# EasyEDA schematic SCH_ModExpES_2025-01-21.json
TITLE: ModExpES; REV: 1.2; Date: 2024-11-28; Sheet: 1/1; Drawn By: Ivo Tofall; Company: Hochschule Bonn-Rhein-Sieg
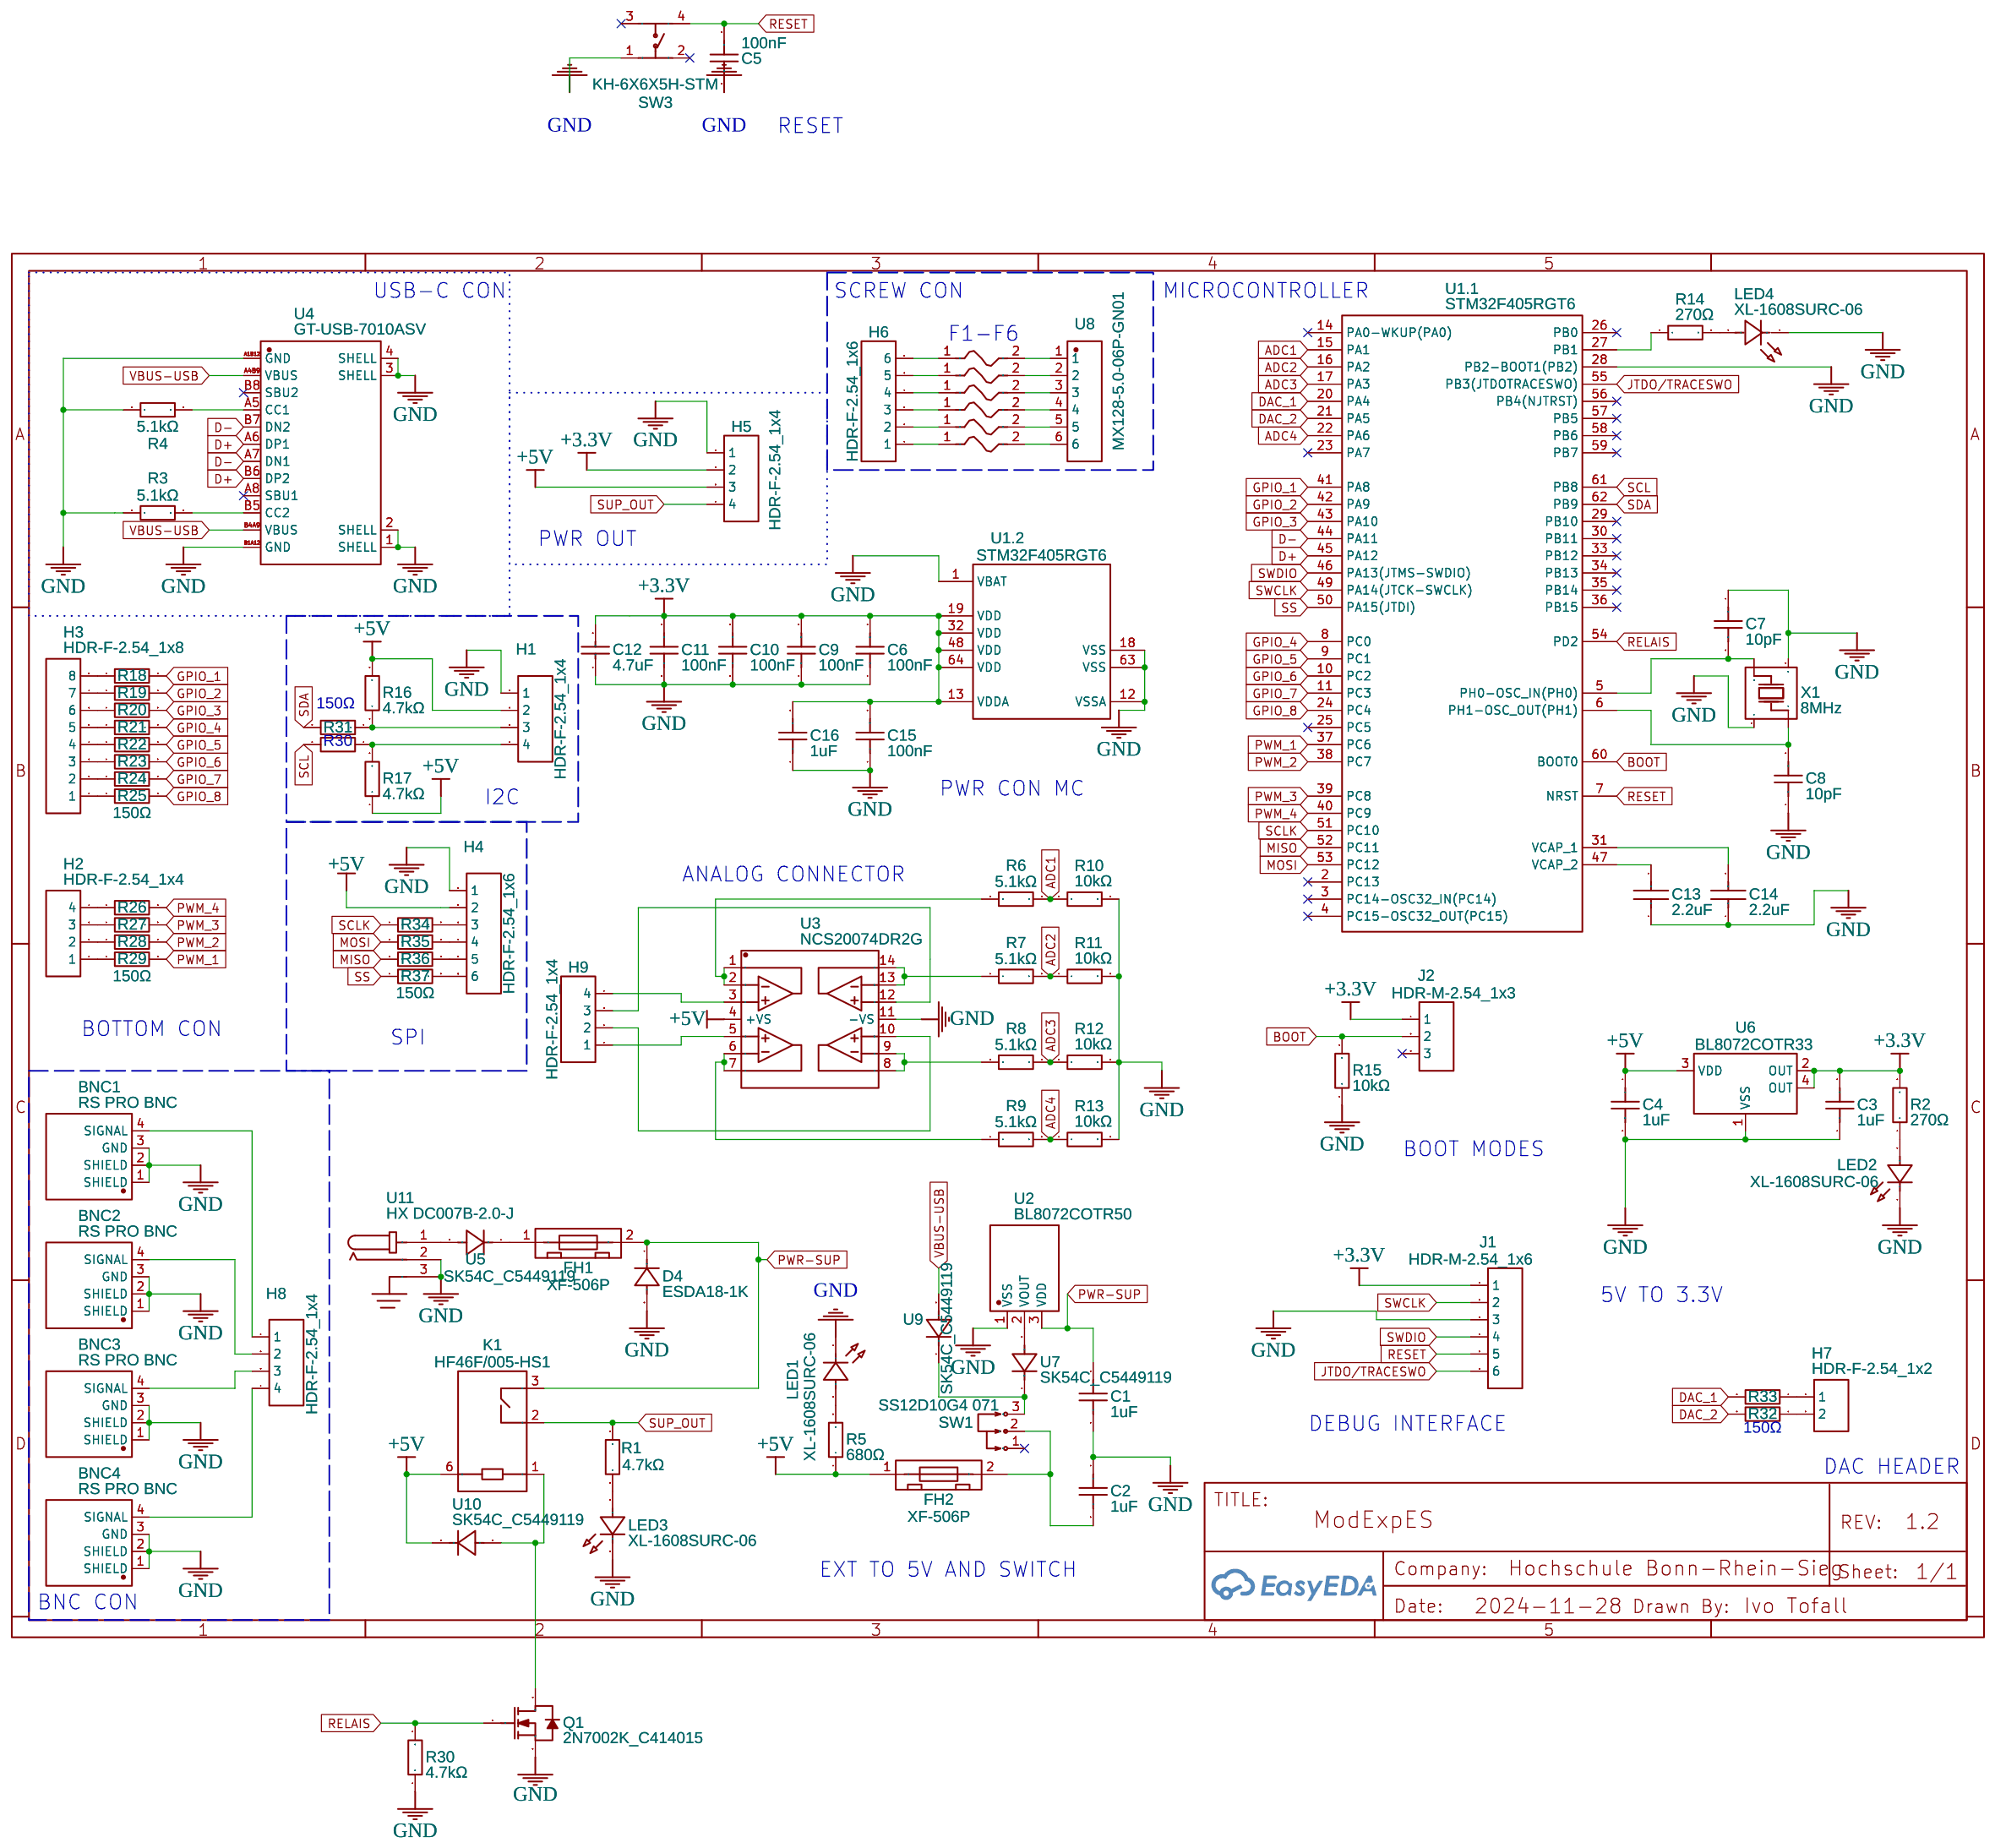
[diagram p0: schematic sheet]

## Parts
150Ω  150Ω  [R0603]
BNC1  RS PRO BNC  [RS PRO BUCHSE KOAXIALSTECKVERBINDER]
BNC2  RS PRO BNC  [RS PRO BUCHSE KOAXIALSTECKVERBINDER]
BNC3  RS PRO BNC  [RS PRO BUCHSE KOAXIALSTECKVERBINDER]
BNC4  RS PRO BNC  [RS PRO BUCHSE KOAXIALSTECKVERBINDER]
C1  1uF  [C0402]
C2  1uF  [C0402]
C3  1uF  [C0402]
C4  1uF  [C0402]
C5  100nF  [C0603]
C6  100nF  [C0402]
C7  10pF  [C0402]
C8  10pF  [C0402]
C9  100nF  [C0402]
C10  100nF  [C0402]
C11  100nF  [C0402]
C12  4.7uF  [C0603]
C13  2.2uF  [C0402]
C14  2.2uF  [C0402]
C15  100nF  [C0402]
C16  1uF  [C0402]
D4  ESDA18-1K  [SOD-523_L1.2-W0.8-LS1.6-RD-1]
F1  TLC-NSMD100/24  [F1206]
F2  TLC-NSMD100/24  [F1206]
F3  TLC-NSMD100/24  [F1206]
F4  TLC-NSMD100/24  [F1206]
F5  TLC-NSMD100/24  [F1206]
F6  TLC-NSMD100/24  [F1206]
FH1  XF-506P  [FUSE-TH_XF-506P]
FH2  XF-506P  [FUSE-TH_XF-506P]
H1  HDR-F-2.54_1x4  [HDR-F-2.54_1X4]
H2  HDR-F-2.54_1x4  [HDR-F-2.54_1X4]
H3  HDR-F-2.54_1x8  [HDR-F-2.54_1X8]
H4  HDR-F-2.54_1x6  [HDR-F-2.54_1X6]
H5  HDR-F-2.54_1x4  [HDR-F-2.54_1X4]
H6  HDR-F-2.54_1x6  [HDR-F-2.54_1X6]
H7  HDR-F-2.54_1x2  [HDR-F-2.54_1X2]
H8  HDR-F-2.54_1x4  [HDR-F-2.54_1X4]
H9  HDR-F-2.54_1x4  [HDR-F-2.54_1X4]
J1  HDR-M-2.54_1x6  [HDR-M-2.54_1X6]
J2  HDR-M-2.54_1x3  [HDR-M-2.54_1X3]
K1  HF46F/005-HS1  [RELAYS-TH_HF46F-XX-HS1-XXX]
LED1  XL-1608SURC-06  [LED0603-RD_RED]
LED2  XL-1608SURC-06  [LED0603-RD_RED]
LED3  XL-1608SURC-06  [LED0603-RD_RED]
LED4  XL-1608SURC-06  [LED0603-RD_RED]
Q1  2N7002K_C414015  [SOT-23-3_L2.9-W1.3-P1.90-LS2.4-BR]
R1  4.7kΩ  [R0805]
R2  270Ω  [R0603]
R3  5.1kΩ  [R0402]
R4  5.1kΩ  [R0402]
R5  680Ω  [R0603]
R6  5.1kΩ  [R0603]
R7  5.1kΩ  [R0603]
R8  5.1kΩ  [R0603]
R9  5.1kΩ  [R0603]
R10  10kΩ  [R0603]
R11  10kΩ  [R0603]
R12  10kΩ  [R0603]
R13  10kΩ  [R0603]
R14  270Ω  [R0603]
R15  10kΩ  [R0603]
R16  4.7kΩ  [R0805]
R17  4.7kΩ  [R0805]
R18  150Ω  [R0603]
R19  150Ω  [R0603]
R20  150Ω  [R0603]
R21  150Ω  [R0603]
R22  150Ω  [R0603]
R23  150Ω  [R0603]
R24  150Ω  [R0603]
R25  150Ω  [R0603]
R26  150Ω  [R0603]
R27  150Ω  [R0603]
R28  150Ω  [R0603]
R29  150Ω  [R0603]
R30  4.7kΩ  [R0805]
R31  150Ω  [R0603]
R32  150Ω  [R0603]
R33  150Ω  [R0603]
R34  150Ω  [R0603]
R35  150Ω  [R0603]
R36  150Ω  [R0603]
R37  150Ω  [R0603]
SW1  SS12D10G4 071  [SW-TH_SHOU-HAN_SS12D10G4]
SW3  KH-6X6X5H-STM  [SW-SMD_4P-L6.0-W6.0-P4.50-LS9.0-2]
U1  STM32F405RGT6  [LQFP-64_L10.0-W10.0-P0.50-LS12.0-BL]  (sections 1,2)
U2  BL8072COTR50  [TO-252-2_L6.5-W6.1-P4.58-LS10.0-BR-1]
U3  NCS20074DR2G  [SOIC-14_L8.7-W3.9-P1.27-LS6.0-BL]
U4  GT-USB-7010ASV  [USB-C-SMD_G-SWITCH_GT-USB-7010ASV]
U5  SK54C_C5449119  [SMC_L6.9-W5.9-LS8.0-RD]
U6  BL8072COTR33  [TO-252-3_L6.6-W6.1-P2.28-LS10.1-BL]
U7  SK54C_C5449119  [SMC_L6.9-W5.9-LS8.0-RD]
U8  MX128-5.0-06P-GN01  [CONN-TH_6P-P5.00_MX128-5.0-06P-GN01-CU-Y-A]
U9  SK54C_C5449119  [SMC_L6.9-W5.9-LS8.0-RD]
U10  SK54C_C5449119  [SMC_L6.9-W5.9-LS8.0-RD]
U11  HX DC007B-2.0-J  [DC-IN-TH_HX-DC007B-2.5]
X1  8MHz  [CRYSTAL-SMD_4P-L3.2-W2.5-BL]

## Library data of the parts
150Ω R18-R29 R31-R37 = 0603WAF1500T5E: Supplier: LCSC; Manufacturer: UNI-ROYAL(厚声); Supplier Part: C22808; JLCPCB Part Class: Basic Part
BNC1-BNC4 = RS PRO BNC: Manufacturer: RS PRO; Manufacturer Part: 546-5109; Supplier: RS-Online; Supplier Part: 546-5109; link: https://docs.rs-online.com/3ac9/0900766b81586486.pdf; Contributor: ivo.tofall
C1-C4 C16 = CL05A105KA5NQNC: Supplier: LCSC; Manufacturer: SAMSUNG(三星); Supplier Part: C52923; JLCPCB Part Class: Basic Part
C5 = CC0603KRX7R9BB104: Supplier: LCSC; Manufacturer: YAGEO(国巨); Supplier Part: C14663; JLCPCB Part Class: Basic Part
C6 C9-C11 C15 = CL05B104KO5NNNC: Supplier: LCSC; Manufacturer: SAMSUNG(三星); Supplier Part: C1525; JLCPCB Part Class: Basic Part
C7 C8 = CL05C100JB5NNNC: Supplier: LCSC; Manufacturer: SAMSUNG(三星); Supplier Part: C32949; JLCPCB Part Class: Basic Part
C12 = CL10A475KO8NNNC: Supplier: LCSC; Manufacturer: SAMSUNG(三星); Supplier Part: C19666; JLCPCB Part Class: Basic Part
C13 C14 = CL05A225MQ5NSNC: Supplier: LCSC; Manufacturer: SAMSUNG(三星); Supplier Part: C12530; JLCPCB Part Class: Basic Part
D4 = ESDA18-1K: Contributor: lcsc; Supplier: LCSC; Supplier Part: C2935156; Manufacturer: ST(意法半导体); JLCPCB Part Class: Extended Part
F1-F6 = TLC-NSMD100/24: Contributor: lcsc; Supplier: LCSC; Supplier Part: C2924939; Manufacturer: TLC(竞沃); JLCPCB Part Class: Extended Part
FH1 FH2 = XF-506P: Contributor: LCSC; Supplier: LCSC; Supplier Part: C492610; Manufacturer: XFCN(兴飞); JLCPCB Part Class: Extended Part
H1 H2 H5 H8 H9 = HDR-F-2.54_1x4: Supplier Part: C225501; Supplier: LCSC; Contributor: LCEDA_Lib
H3 = HDR-F-2.54_1x8: Supplier Part: C225505; Supplier: LCSC; Contributor: LCEDA_Lib
H4 H6 = HDR-F-2.54_1x6: Supplier Part: C40877; Supplier: LCSC; Contributor: LCEDA_Lib
H7 = HDR-F-2.54_1x2: Supplier Part: C49661; Supplier: LCSC; Contributor: LCEDA_Lib
J1 = HDR-M-2.54_1x6: Supplier Part: C190819; Supplier: LCSC; Contributor: LCEDA_Lib
J2 = HDR-M-2.54_1x3: Supplier Part: C180248; Supplier: LCSC; Contributor: LCEDA_Lib
K1 = HF46F/005-HS1: Supplier: LCSC; Supplier Part: C2976849; Manufacturer: HF(宏发); JLCPCB Part Class: Extended Part; Contributor: lcsc
LED1-LED4 = XL-1608SURC-06: Contributor: LCSC; Supplier: LCSC; Supplier Part: C965799; Manufacturer: XINGLIGHT(成兴光); JLCPCB Part Class: Extended Part
Q1 = 2N7002K_C414015: Contributor: LCSC; Supplier: LCSC; Supplier Part: C414015; Manufacturer: MDD(辰达半导体); Manufacturer Part: 2N7002K; JLCPCB Part Class: Extended Part
R1 R16 R17 R30 = 0805W8F4701T5E: Supplier: LCSC; Manufacturer: UNI-ROYAL(厚声); Supplier Part: C17673; JLCPCB Part Class: Basic Part
R2 R14 = 0603WAF2700T5E: Supplier: LCSC; Manufacturer: UNI-ROYAL(厚声); Supplier Part: C22966; JLCPCB Part Class: Basic Part
R3 R4 = 0402WGF5101TCE: Supplier: LCSC; Manufacturer: UNI-ROYAL(厚声); Supplier Part: C25905; JLCPCB Part Class: Basic Part
R5 = 0603WAF6800T5E: Supplier: LCSC; Manufacturer: UNI-ROYAL(厚声); Supplier Part: C23228; JLCPCB Part Class: Basic Part
R6-R9 = 0603WAF5101T5E: Supplier: LCSC; Manufacturer: UNI-ROYAL(厚声); Supplier Part: C23186; JLCPCB Part Class: Basic Part
R10-R13 R15 = 0603WAF1002T5E: Supplier: LCSC; Manufacturer: UNI-ROYAL(厚声); Supplier Part: C25804; JLCPCB Part Class: Basic Part
SW1 = SS12D10G4 071: Contributor: LCSC; Supplier: LCSC; Supplier Part: C2887259; Manufacturer: SHOU HAN(首韩); JLCPCB Part Class: Extended Part
SW3 = KH-6X6X5H-STM: Contributor: LCSC; Supplier: LCSC; Supplier Part: C2837531; Manufacturer: kinghelm(金航标); JLCPCB Part Class: Extended Part
U1 = STM32F405RGT6: tags: STM32; subpart_no: 1; image: http://image.lceda.cn/szlcsc/C15742.jpg; Supplier Part: C15742; Supplier: LCSC; Manufacturer: ST(意法半导体); JLCPCB Part Class: Extended Part
U2 = BL8072COTR50: Contributor: LCSC; Supplier: LCSC; Supplier Part: C213389; Manufacturer: BL(上海贝岭); JLCPCB Part Class: Extended Part
U3 = NCS20074DR2G: Contributor: LCSC; Supplier: LCSC; Supplier Part: C89844; Manufacturer: onsemi(安森美); JLCPCB Part Class: Extended Part
U4 = GT-USB-7010ASV: Contributor: lcsc; Supplier: LCSC; Supplier Part: C2988369; Manufacturer: G-Switch(品赞); JLCPCB Part Class: Extended Part
U5 U7 U9 U10 = SK54C_C5449119: Supplier: LCSC; Supplier Part: C5449119; Manufacturer: MSKSEMI(美森科); Manufacturer Part: SK54C; Contributor: lcsc; JLCPCB Part Class: Extended Part
U6 = BL8072COTR33: Contributor: lcsc; Supplier: LCSC; Supplier Part: C5155191; Manufacturer: BL(上海贝岭); JLCPCB Part Class: Extended Part
U8 = MX128-5.0-06P-GN01-CU-Y-A: Supplier: LCSC; Supplier Part: C5290371; Manufacturer: MAX(迈旭); Manufacturer Part: MX128-5.0-06P-GN01-Cu-Y-A; JLCPCB Part Class: Extended Part; Contributor: lcsc
U11 = HX DC007B-2.0-J: Supplier: LCSC; Supplier Part: C19189082; Manufacturer: hanxia(韩下); Contributor: lcsc; JLCPCB Part Class: Extended Part
X1 = TAXM8M4RDBCCT2T: Contributor: LCSC; Supplier: LCSC; Supplier Part: C400090; Manufacturer: YJX(雅晶鑫); JLCPCB Part Class: Extended Part

## Nets
+3.3V: C3.2 C6.2 C9.2 C10.2 C11.2 C12.2 C15.2 C16.2 H5.2 J1.1 J2.1 R2.2 U1.13(VDDA) U1.19(VDD) U1.32(VDD) U1.48(VDD) U1.64(VDD) U6.2(OUT) U6.4(OUT)
+5V: C4.1 FH2.1 H1.2 H4.2 H5.3 K1.6 R5.1 R16.2 R17.1 U3.4(+VS) U6.3(VDD) U10.1(C)
GND: BNC1.1(SHIELD) BNC1.2(SHIELD) BNC1.3(GND) BNC2.1(SHIELD) BNC2.2(SHIELD) BNC2.3(GND) BNC3.1(SHIELD) BNC3.2(SHIELD) BNC3.3(GND) BNC4.1(SHIELD) BNC4.2(SHIELD) BNC4.3(GND) C1.1 C2.1 C3.1 C4.2 C5.2 C6.1 C7.1 C8.1 C9.1 C10.1 C11.1 C12.1 C13.1 C14.1 C15.1 C16.1 D4.2(A) H1.1 H4.1 H5.1 J1.3 LED1.1(K) LED2.1(K) LED3.1(K) LED4.1(K) Q1.2(S) R3.1 R4.1 R10.2 R11.2 R12.2 R13.2 R15.2 R30.1 SW3.1 U1.1(VBAT) U1.12(VSSA) U1.18(VSS) U1.28(PB2-BOOT1(PB2)) U1.63(VSS) U2.1(VSS) U3.11(-VS) U4.1(SHELL) U4.2(SHELL) U4.3(SHELL) U4.4(SHELL) U4.A1B12(GND) U4.B1A12(GND) U6.1(VSS) U11.2 U11.3 X1.2 X1.4
VBUS-USB: U4.A4B9(VBUS) U4.B4A9(VBUS) U9.2(A)
ADC1: R6.2 R10.1 U1.15(PA1)
ADC2: R7.2 R11.1 U1.16(PA2)
ADC3: R8.2 R12.1 U1.17(PA3)
ADC4: R9.2 R13.1 U1.22(PA6)
BOOT: J2.2 R15.1 U1.60(BOOT0)
D+: U1.45(PA12) U4.A6(DP1) U4.B6(DP2)
D-: U1.44(PA11) U4.A7(DN1) U4.B7(DN2)
DAC_1: R33.2 U1.20(PA4)
DAC_2: R32.2 U1.21(PA5)
GPIO_1: R18.2 U1.41(PA8)
GPIO_2: R19.2 U1.42(PA9)
GPIO_3: R20.2 U1.43(PA10)
GPIO_4: R21.2 U1.8(PC0)
GPIO_5: R22.2 U1.9(PC1)
GPIO_6: R23.2 U1.10(PC2)
GPIO_7: R24.2 U1.11(PC3)
GPIO_8: R25.2 U1.24(PC4)
JTDO/TRACESWO: J1.6 U1.55(PB3(JTDOTRACESWO))
MISO: R36.1 U1.52(PC11)
MOSI: R35.1 U1.53(PC12)
PWM_1: R29.2 U1.37(PC6)
PWM_2: R28.2 U1.38(PC7)
PWM_3: R27.2 U1.39(PC8)
PWM_4: R26.2 U1.40(PC9)
PWR-SUP: C1.2 D4.1(K) FH1.2 K1.3 U2.3(VDD)
RELAIS: Q1.1(G) R30.2 U1.54(PD2)
RESET: C5.1 J1.5 SW3.4 U1.7(NRST)
SCL: 150Ω.2 U1.61(PB8)
SCLK: R34.1 U1.51(PC10)
SDA: R31.2 U1.62(PB9)
SS: R37.1 U1.50(PA15(JTDI))
SUP_OUT: H5.4 K1.2 R1.1
SWCLK: J1.2 U1.49(PA14(JTCK-SWCLK))
SWDIO: J1.4 U1.46(PA13(JTMS-SWDIO))
Net-(150Ω-1): 150Ω.1 H1.4 R17.2
Net-(BNC1-4): BNC1.4(SIGNAL) H8.1
Net-(BNC2-4): BNC2.4(SIGNAL) H8.2
Net-(BNC3-4): BNC3.4(SIGNAL) H8.3
Net-(BNC4-4): BNC4.4(SIGNAL) H8.4
Net-(C2-2): C2.2 FH2.2 SW1.2
Net-(C7-2): C7.2 U1.5(PH0-OSC_IN(PH0)) X1.3
Net-(C8-2): C8.2 U1.6(PH1-OSC_OUT(PH1)) X1.1
Net-(C13-2): C13.2 U1.47(VCAP_2)
Net-(C14-2): C14.2 U1.31(VCAP_1)
Net-(F1-1): F1.1 H6.1
Net-(F1-2): F1.2 U8.6
Net-(F2-1): F2.1 H6.2
Net-(F2-2): F2.2 U8.5
Net-(F3-1): F3.1 H6.3
Net-(F3-2): F3.2 U8.4
Net-(F4-1): F4.1 H6.4
Net-(F4-2): F4.2 U8.3
Net-(F5-1): F5.1 H6.5
Net-(F5-2): F5.2 U8.2
Net-(F6-1): F6.1 H6.6
Net-(F6-2): F6.2 U8.1
Net-(FH1-1): FH1.1 U5.1(C)
Net-(H1-3): H1.3 R16.1 R31.1
Net-(H2-1): H2.1 R29.1
Net-(H2-2): H2.2 R28.1
Net-(H2-3): H2.3 R27.1
Net-(H2-4): H2.4 R26.1
Net-(H3-1): H3.1 R25.1
Net-(H3-2): H3.2 R24.1
Net-(H3-3): H3.3 R23.1
Net-(H3-4): H3.4 R22.1
Net-(H3-5): H3.5 R21.1
Net-(H3-6): H3.6 R20.1
Net-(H3-7): H3.7 R19.1
Net-(H3-8): H3.8 R18.1
Net-(H4-3): H4.3 R34.2
Net-(H4-4): H4.4 R35.2
Net-(H4-5): H4.5 R36.2
Net-(H4-6): H4.6 R37.2
Net-(H7-1): H7.1 R33.1
Net-(H7-2): H7.2 R32.1
Net-(H9-1): H9.1 U3.5
Net-(H9-2): H9.2 U3.10
Net-(H9-3): H9.3 U3.12
Net-(H9-4): H9.4 U3.3
Net-(K1-1): K1.1 Q1.3(D) U10.2(A)
Net-(LED1-2): LED1.2(A) R5.2
Net-(LED2-2): LED2.2(A) R2.1
Net-(LED3-2): LED3.2(A) R1.2
Net-(LED4-2): LED4.2(A) R14.2
Net-(R3-2): R3.2 U4.B5(CC2)
Net-(R4-2): R4.2 U4.A5(CC1)
Net-(R6-1): R6.1 U3.1 U3.2
Net-(R7-1): R7.1 U3.13 U3.14
Net-(R8-1): R8.1 U3.8 U3.9
Net-(R9-1): R9.1 U3.6 U3.7
Net-(R14-1): R14.1 U1.27(PB1)
Net-(SW1-3): SW1.3 U7.1(C) U9.1(C)
Net-(U2-2): U2.2(VOUT) U7.2(A)
Net-(U5-2): U5.2(A) U11.1

Not connected (* = marked no-connect by the designer): J2 3*; SW1 1*; SW3 2* 3*; U1 2(PC13)* 3(PC14-OSC32_IN(PC14))* 4(PC15-OSC32_OUT(PC15))* 14(PA0-WKUP(PA0))* 23(PA7)* 25(PC5)* 26(PB0)* 29(PB10)* 30(PB11)* 33(PB12)* 34(PB13)* 35(PB14)* 36(PB15)* 56(PB4(NJTRST))* 57(PB5)* 58(PB6)* 59(PB7)*; U4 A8(SBU1)* B8(SBU2)*

## Notes on the sheet
- RESET
- USB-C CON
- SCREW CON
- MICROCONTROLLER
- F1-F6
- PWR OUT
- 150Ω
- R30
- PWR CON MC
- I2C
- ANALOG CONNECTOR
- BOTTOM CON
- SPI
- BOOT MODES
- 5V TO 3.3V
- DEBUG INTERFACE
- 150Ω
- DAC HEADER
- EXT TO 5V AND SWITCH
- BNC CON
